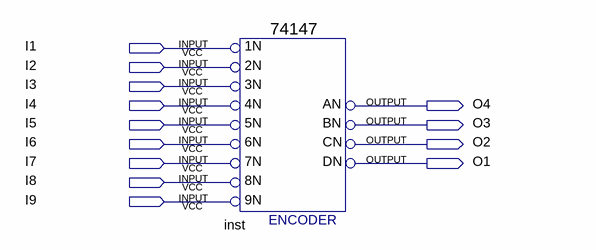
[diagram p0: schematic sheet]
// Quartus schematic sikao1.bdf as structural Verilog: 1 symbols, 13 pins
module sikao1 (
  input  I1,
  input  I2,
  input  I3,
  input  I4,
  input  I5,
  input  I6,
  input  I7,
  input  I8,
  input  I9,
  output O4,
  output O3,
  output O2,
  output O1
);

  \74147  inst (
    .\1N (I1), .\2N (I2), .\3N (I3), .\6N (I6), .\5N (I5), .\4N (I4), .\9N (I9), .\8N (I8), .\7N (I7),
    .CN(O2), .BN(O3), .AN(O4), .DN(O1));
endmodule
